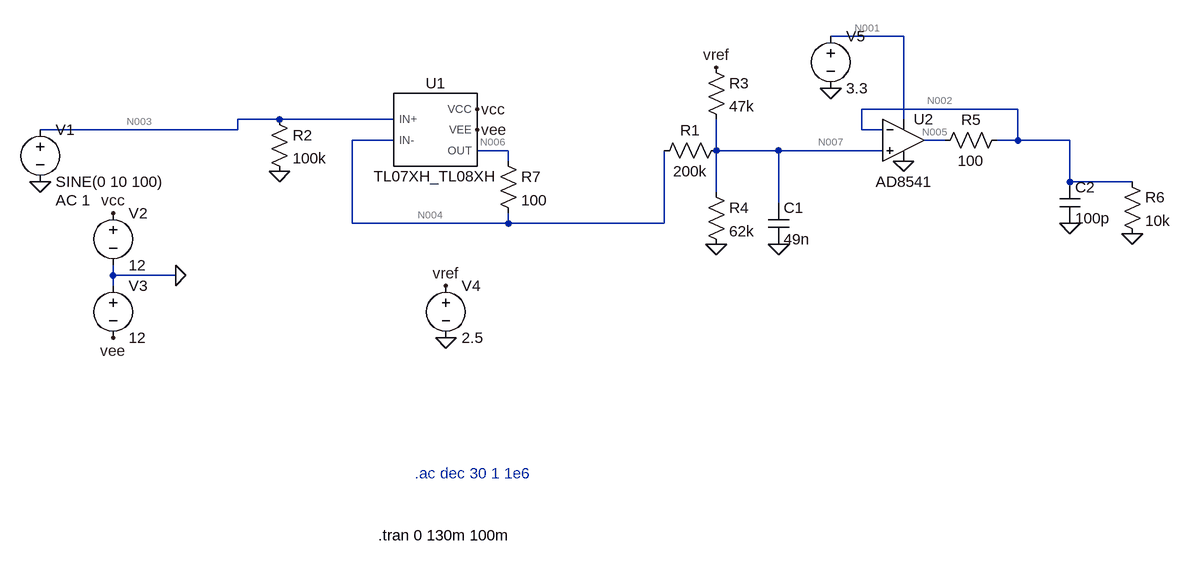
[diagram p0: schematic adc_driver.asc]
adc_driver.asc, the LTspice schematic file:
Version 4.1
SHEET 1 1684 768
WIRE 1264 -16 1152 -16
WIRE 1440 96 1200 96
WIRE 304 112 240 112
WIRE 480 112 304 112
WIRE 1264 112 1264 -16
WIRE 240 128 240 112
WIRE 240 128 -64 128
WIRE 1200 128 1200 96
WIRE 1232 128 1200 128
WIRE 480 144 416 144
WIRE 1328 144 1296 144
WIRE 1440 144 1440 96
WIRE 1440 144 1408 144
WIRE 1520 144 1440 144
WIRE 656 160 608 160
WIRE 976 160 976 112
WIRE 1072 160 976 160
WIRE 1232 160 1072 160
WIRE 656 176 656 160
WIRE 1520 208 1520 144
WIRE 1616 208 1520 208
WIRE 976 224 976 160
WIRE 1072 240 1072 160
WIRE 416 272 416 144
WIRE 656 272 656 256
WIRE 656 272 416 272
WIRE 896 272 896 160
WIRE 896 272 656 272
WIRE 48 352 48 336
WIRE 144 352 48 352
WIRE 48 368 48 352
FLAG -64 208 0
FLAG 144 352 0
FLAG 48 256 vcc
FLAG 48 448 vee
FLAG 608 96 vcc
FLAG 608 128 vee
FLAG 304 192 0
FLAG 976 304 0
FLAG 560 448 0
FLAG 560 368 vref
FLAG 976 32 vref
FLAG 1072 304 0
FLAG 1264 176 0
FLAG 1152 64 0
FLAG 1520 272 0
FLAG 1616 288 0
SYMBOL voltage -64 112 R0
WINDOW 123 24 124 Left 2
WINDOW 39 0 0 Left 0
SYMATTR Value2 AC 1
SYMATTR InstName V1
SYMATTR Value SINE(0 10 100)
SYMBOL res 992 144 R90
WINDOW 0 0 56 VBottom 2
WINDOW 3 32 56 VTop 2
SYMATTR InstName R1
SYMATTR Value 200k
SYMBOL TL07XH_TL08XH 544 128 R0
SYMATTR InstName U1
SYMBOL voltage 48 240 R0
WINDOW 123 0 0 Left 0
WINDOW 39 0 0 Left 0
SYMATTR InstName V2
SYMATTR Value 12
SYMBOL voltage 48 352 R0
WINDOW 123 0 0 Left 0
WINDOW 39 0 0 Left 0
SYMATTR InstName V3
SYMATTR Value 12
SYMBOL res 288 96 R0
SYMATTR InstName R2
SYMATTR Value 100k
SYMBOL res 960 16 R0
SYMATTR InstName R3
SYMATTR Value 47k
SYMBOL res 960 208 R0
SYMATTR InstName R4
SYMATTR Value 62k
SYMBOL voltage 560 352 R0
WINDOW 123 0 0 Left 0
WINDOW 39 0 0 Left 0
SYMATTR InstName V4
SYMATTR Value 2.5
SYMBOL cap 1056 240 R0
SYMATTR InstName C1
SYMATTR Value 49n
SYMBOL OpAmps\\AD8541 1264 80 R0
WINDOW 3 -43 128 Left 2
SYMATTR InstName U2
SYMBOL voltage 1152 -32 R0
WINDOW 123 0 0 Left 0
WINDOW 39 0 0 Left 0
SYMATTR InstName V5
SYMATTR Value 3.3
SYMBOL res 1424 128 R90
WINDOW 0 0 56 VBottom 2
WINDOW 3 32 56 VTop 2
SYMATTR InstName R5
SYMATTR Value 100
SYMBOL cap 1504 208 R0
SYMATTR InstName C2
SYMATTR Value 100p
SYMBOL res 1600 192 R0
SYMATTR InstName R6
SYMATTR Value 10k
SYMBOL res 640 160 R0
SYMATTR InstName R7
SYMATTR Value 100
TEXT 512 656 Left 2 ;.ac dec 30 1 1e6
TEXT 456 752 Left 2 !.tran 0 130m 100m

The netlist it stands for:
* adc_driver.asc
V1 N003 0 SINE(0 10 100) AC 1
R1 N007 N004 200k
X§U1 N003 N004 vcc vee N006 TL07XH_TL08XH  ; pins IN+ IN- VCC VEE OUT
V2 vcc 0 12
V3 0 vee 12
R2 N003 0 100k
R3 vref N007 47k
R4 N007 0 62k
V4 vref 0 2.5
C1 N007 0 49n
X§U2 N007 N002 N001 0 N005 AD8541  ; pins In+ In- V+ V- OUT
V5 N001 0 3.3
R5 N002 N005 100
C2 N002 0 100p
R6 N002 0 10k
R7 N006 N004 100
* .ac dec 30 1 1e6
.tran 0 130m 100m
.lib tl07xh_tl08xh.lib
.backanno
.end

* Results of the author's LTspice run, read from the files saved beside the schematic
* Operating Point, zero values left out:
*   V(n001) = 3.3 V
*   V(n002) = 1.253 V
*   V(n004) = -4.428 mV
*   V(n005) = 1.266 V
*   V(n006) = -5.057 mV
*   V(n007) = 1.254 V
*   V(vcc) = 12 V
*   V(vee) = -12 V
*   V(vref) = 2.5 V
*   I(R1) = 6.291 µA
*   I(R3) = 26.51 µA
*   I(R4) = 20.22 µA
*   I(R5) = -125.3 µA
*   I(R6) = 125.3 µA
*   I(R7) = -6.291 µA
*   I(V2) = -937.5 µA
*   I(V3) = -943.8 µA
*   I(V4) = -26.51 µA
*   I(V5) = -158.7 µA
*   Ix(u1:out) = 6.291 µA
*   Ix(u1:vcc) = 937.5 µA
*   Ix(u1:vee) = -943.8 µA
*   Ix(u2:45) = -125.3 µA
*   Ix(u2:50) = -33.44 µA
*   Ix(u2:99) = 158.7 µA
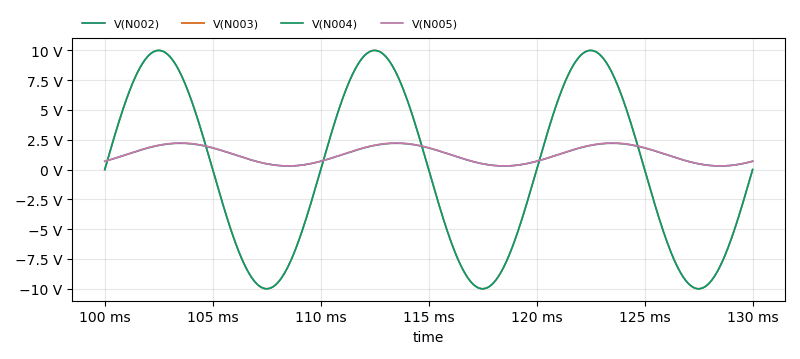
[diagram p1: Transient Analysis of adc_driver.asc, plotted from the saved traces]
* Transient Analysis, 1 run:
*   V(N002): min 299.8 mV, max 2.207 V, average 1.253 V, rms 1.423 V, last 692.9 mV
*   V(N003): min -10 V, max 10 V, average 0 V, rms 7.071 V, last 0 V
*   V(N004): min -10 V, max 9.996 V, average -4.423 mV, rms 7.071 V, last -4.576 mV
*   V(N005): min 302.8 mV, max 2.229 V, average 1.266 V, rms 1.437 V, last 699.9 mV